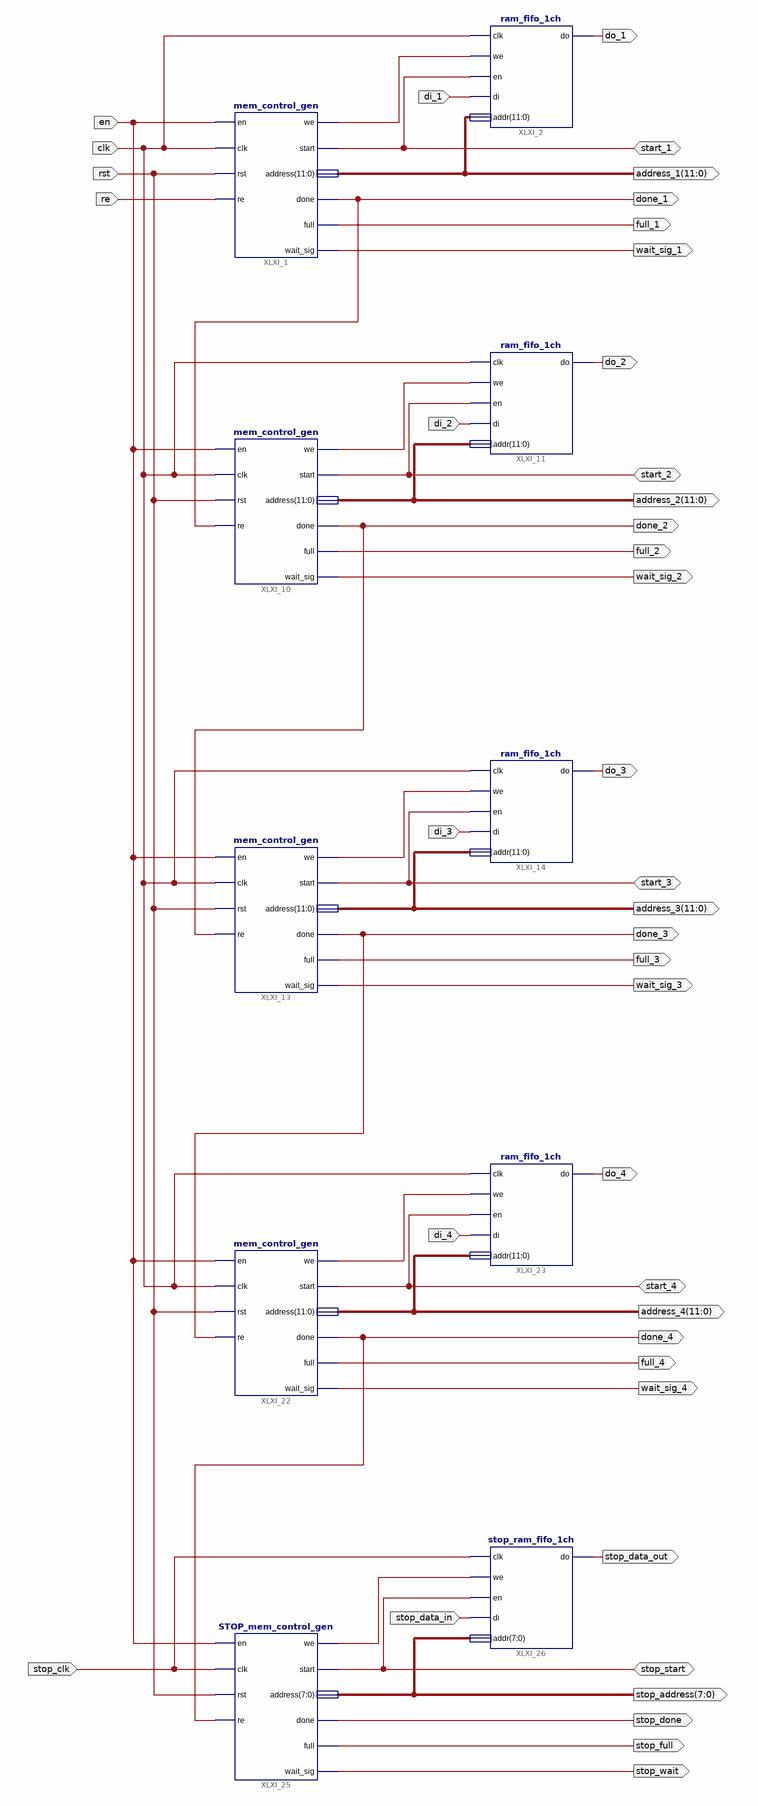
[diagram p0: schematic sheet 1]
// Xilinx ISE schematic MEMORY_BLOCK_NEW.sch (spartan3a) as structural Verilog: 10 symbols, 40 ports
module MEMORY_BLOCK_NEW (
  input  en,
  input  clk,
  input  di_1,
  input  re,
  input  di_2,
  input  di_3,
  input  di_4,
  input  stop_clk,
  input  stop_data_in,
  input  rst,
  inout  start_1,
  inout  start_2,
  inout  start_3,
  inout  start_4,
  inout  stop_start,
  output [11:0] address_1,
  output done_1,
  output full_1,
  output wait_sig_1,
  output [11:0] address_3,
  output [11:0] address_2,
  output [11:0] address_4,
  output done_2,
  output full_2,
  output wait_sig_2,
  output done_3,
  output full_3,
  output wait_sig_3,
  output done_4,
  output full_4,
  output wait_sig_4,
  output [7:0] stop_address,
  output stop_done,
  output stop_full,
  output stop_wait,
  output stop_data_out,
  output do_4,
  output do_3,
  output do_2,
  output do_1
);

  wire XLXN_24, XLXN_89, XLXN_94, XLXN_101, XLXN_114;

  mem_control_gen XLXI_1 (
    .en(en), .clk(clk), .re(re), .rst(rst), .we(XLXN_24), .start(start_1), .address(address_1),
    .done(done_1), .full(full_1), .wait_sig(wait_sig_1));
  ram_fifo_1ch XLXI_2 (.clk(clk), .we(XLXN_24), .en(start_1), .di(di_1), .addr(address_1), .\do (do_1));
  mem_control_gen XLXI_10 (
    .en(en), .clk(clk), .re(done_1), .rst(rst), .we(XLXN_89), .start(start_2), .address(address_2),
    .done(done_2), .full(full_2), .wait_sig(wait_sig_2));
  ram_fifo_1ch XLXI_11 (.clk(clk), .we(XLXN_89), .en(start_2), .di(di_2), .addr(address_2), .\do (do_2));
  mem_control_gen XLXI_13 (
    .en(en), .clk(clk), .re(done_2), .rst(rst), .we(XLXN_94), .start(start_3), .address(address_3),
    .done(done_3), .full(full_3), .wait_sig(wait_sig_3));
  ram_fifo_1ch XLXI_14 (.clk(clk), .we(XLXN_94), .en(start_3), .di(di_3), .addr(address_3), .\do (do_3));
  mem_control_gen XLXI_22 (
    .en(en), .clk(clk), .re(done_3), .rst(rst), .we(XLXN_101), .start(start_4), .address(address_4),
    .done(done_4), .full(full_4), .wait_sig(wait_sig_4));
  ram_fifo_1ch XLXI_23 (.clk(clk), .we(XLXN_101), .en(start_4), .di(di_4), .addr(address_4), .\do (do_4));
  STOP_mem_control_gen XLXI_25 (
    .en(en), .rst(rst), .re(done_4), .clk(stop_clk), .start(stop_start), .full(stop_full), .done(stop_done),
    .wait_sig(stop_wait), .we(XLXN_114), .address(stop_address));
  stop_ram_fifo_1ch XLXI_26 (
    .clk(stop_clk), .we(XLXN_114), .en(stop_start), .di(stop_data_in), .addr(stop_address),
    .\do (stop_data_out));
endmodule
